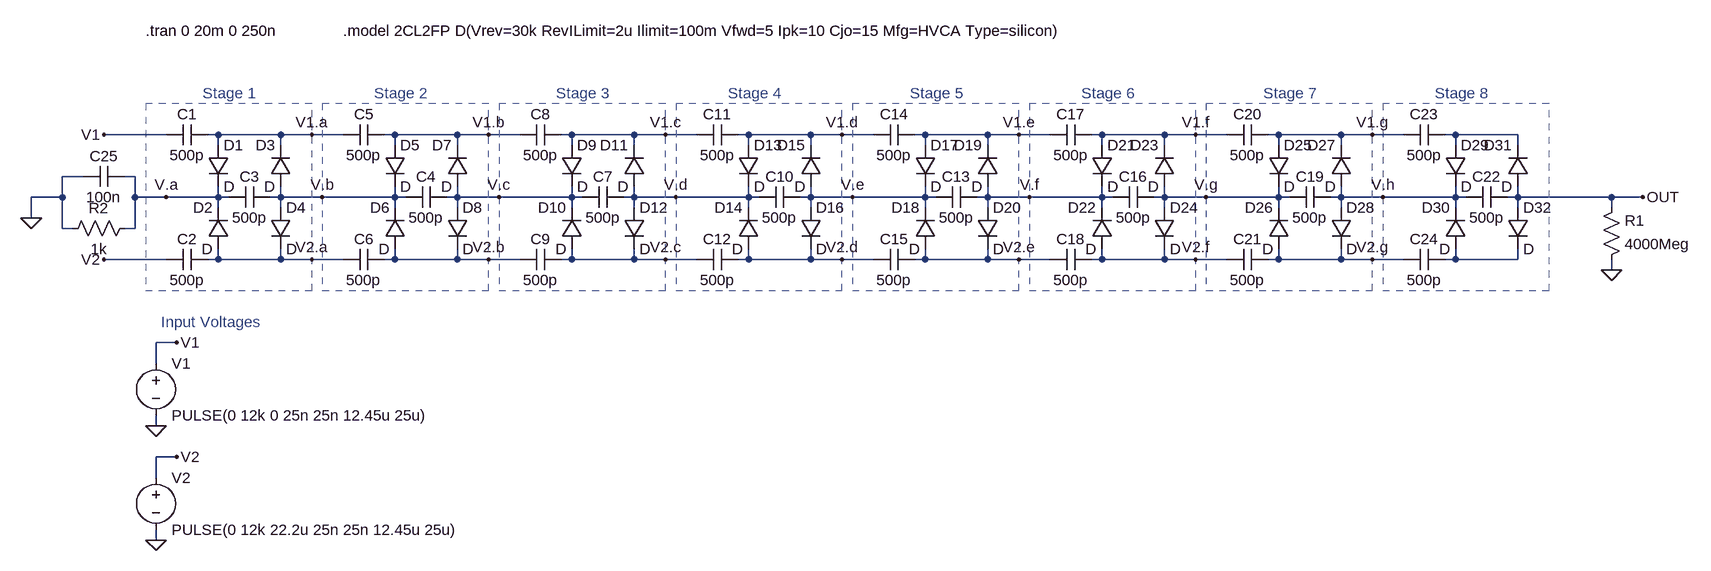
[diagram p0: schematic voltage_mutiplier.asc]
voltage_mutiplier.asc, the LTspice schematic file:
Version 4.1
SHEET 1 2372 756
WIRE 16 112 -80 112
WIRE 96 112 80 112
WIRE 192 112 96 112
WIRE 240 112 192 112
WIRE 288 112 240 112
WIRE 368 112 352 112
WIRE 464 112 368 112
WIRE 512 112 464 112
WIRE 560 112 512 112
WIRE 640 112 624 112
WIRE 736 112 640 112
WIRE 784 112 736 112
WIRE 832 112 784 112
WIRE 912 112 896 112
WIRE 1008 112 912 112
WIRE 1056 112 1008 112
WIRE 1104 112 1056 112
WIRE 1184 112 1168 112
WIRE 1280 112 1184 112
WIRE 1328 112 1280 112
WIRE 1376 112 1328 112
WIRE 1456 112 1440 112
WIRE 1552 112 1456 112
WIRE 1600 112 1552 112
WIRE 1648 112 1600 112
WIRE 1728 112 1712 112
WIRE 1824 112 1728 112
WIRE 1872 112 1824 112
WIRE 1920 112 1872 112
WIRE 2000 112 1984 112
WIRE 2096 112 2000 112
WIRE 96 128 96 112
WIRE 192 128 192 112
WIRE 368 128 368 112
WIRE 464 128 464 112
WIRE 640 128 640 112
WIRE 736 128 736 112
WIRE 912 128 912 112
WIRE 1008 128 1008 112
WIRE 1184 128 1184 112
WIRE 1280 128 1280 112
WIRE 1456 128 1456 112
WIRE 1552 128 1552 112
WIRE 1728 128 1728 112
WIRE 1824 128 1824 112
WIRE 2000 128 2000 112
WIRE 2096 128 2096 112
WIRE -112 176 -144 176
WIRE -32 176 -48 176
WIRE -144 208 -144 176
WIRE -144 208 -192 208
WIRE -32 208 -32 176
WIRE 16 208 -32 208
WIRE 96 208 96 192
WIRE 96 208 16 208
WIRE 112 208 96 208
WIRE 192 208 192 192
WIRE 192 208 176 208
WIRE 256 208 192 208
WIRE 368 208 368 192
WIRE 368 208 256 208
WIRE 384 208 368 208
WIRE 464 208 464 192
WIRE 464 208 448 208
WIRE 528 208 464 208
WIRE 640 208 640 192
WIRE 640 208 528 208
WIRE 656 208 640 208
WIRE 736 208 736 192
WIRE 736 208 720 208
WIRE 800 208 736 208
WIRE 912 208 912 192
WIRE 912 208 800 208
WIRE 928 208 912 208
WIRE 1008 208 1008 192
WIRE 1008 208 992 208
WIRE 1072 208 1008 208
WIRE 1184 208 1184 192
WIRE 1184 208 1072 208
WIRE 1200 208 1184 208
WIRE 1280 208 1280 192
WIRE 1280 208 1264 208
WIRE 1344 208 1280 208
WIRE 1456 208 1456 192
WIRE 1456 208 1344 208
WIRE 1472 208 1456 208
WIRE 1552 208 1552 192
WIRE 1552 208 1536 208
WIRE 1616 208 1552 208
WIRE 1728 208 1728 192
WIRE 1728 208 1616 208
WIRE 1744 208 1728 208
WIRE 1824 208 1824 192
WIRE 1824 208 1808 208
WIRE 1888 208 1824 208
WIRE 2000 208 2000 192
WIRE 2000 208 1888 208
WIRE 2016 208 2000 208
WIRE 2096 208 2096 192
WIRE 2096 208 2080 208
WIRE 2240 208 2096 208
WIRE 2288 208 2240 208
WIRE 96 224 96 208
WIRE 192 224 192 208
WIRE 368 224 368 208
WIRE 464 224 464 208
WIRE 640 224 640 208
WIRE 736 224 736 208
WIRE 912 224 912 208
WIRE 1008 224 1008 208
WIRE 1184 224 1184 208
WIRE 1280 224 1280 208
WIRE 1456 224 1456 208
WIRE 1552 224 1552 208
WIRE 1728 224 1728 208
WIRE 1824 224 1824 208
WIRE 2000 224 2000 208
WIRE 2096 224 2096 208
WIRE 2240 224 2240 208
WIRE -192 240 -192 208
WIRE -144 256 -144 208
WIRE -128 256 -144 256
WIRE -32 256 -32 208
WIRE -32 256 -48 256
WIRE 16 304 -80 304
WIRE 96 304 96 288
WIRE 96 304 80 304
WIRE 192 304 192 288
WIRE 192 304 96 304
WIRE 240 304 192 304
WIRE 288 304 240 304
WIRE 368 304 368 288
WIRE 368 304 352 304
WIRE 464 304 464 288
WIRE 464 304 368 304
WIRE 512 304 464 304
WIRE 560 304 512 304
WIRE 640 304 640 288
WIRE 640 304 624 304
WIRE 736 304 736 288
WIRE 736 304 640 304
WIRE 784 304 736 304
WIRE 832 304 784 304
WIRE 912 304 912 288
WIRE 912 304 896 304
WIRE 1008 304 1008 288
WIRE 1008 304 912 304
WIRE 1056 304 1008 304
WIRE 1104 304 1056 304
WIRE 1184 304 1184 288
WIRE 1184 304 1168 304
WIRE 1280 304 1280 288
WIRE 1280 304 1184 304
WIRE 1328 304 1280 304
WIRE 1376 304 1328 304
WIRE 1456 304 1456 288
WIRE 1456 304 1440 304
WIRE 1552 304 1552 288
WIRE 1552 304 1456 304
WIRE 1600 304 1552 304
WIRE 1648 304 1600 304
WIRE 1728 304 1728 288
WIRE 1728 304 1712 304
WIRE 1824 304 1824 288
WIRE 1824 304 1728 304
WIRE 1872 304 1824 304
WIRE 1920 304 1872 304
WIRE 2000 304 2000 288
WIRE 2000 304 1984 304
WIRE 2096 304 2096 288
WIRE 2096 304 2000 304
WIRE 2240 320 2240 304
WIRE 32 432 0 432
WIRE 0 464 0 432
WIRE 0 560 0 544
WIRE 32 608 0 608
WIRE 0 640 0 608
WIRE 0 736 0 720
FLAG 2240 320 0
FLAG 2288 208 OUT
FLAG -192 240 0
FLAG -80 112 V1
FLAG -80 304 V2
FLAG 240 304 V2.a
FLAG 512 304 V2.b
FLAG 784 304 V2.c
FLAG 1056 304 V2.d
FLAG 1328 304 V2.e
FLAG 1600 304 V2.f
FLAG 1872 304 V2.g
FLAG 240 112 V1.a
FLAG 512 112 V1.b
FLAG 784 112 V1.c
FLAG 1056 112 V1.d
FLAG 1328 112 V1.e
FLAG 1600 112 V1.f
FLAG 1872 112 V1.g
FLAG 0 560 0
FLAG 0 736 0
FLAG 32 608 V2
FLAG 32 432 V1
FLAG 16 208 V.a
FLAG 256 208 V.b
FLAG 528 208 V.c
FLAG 800 208 V.d
FLAG 1072 208 V.e
FLAG 1344 208 V.f
FLAG 1616 208 V.g
FLAG 1888 208 V.h
SYMBOL diode 80 128 R0
SYMATTR InstName D1
SYMBOL diode 112 288 R180
WINDOW 0 24 64 Left 2
WINDOW 3 24 0 Left 2
SYMATTR InstName D2
SYMBOL cap 176 192 R90
WINDOW 0 0 32 VBottom 2
WINDOW 3 32 32 VTop 2
SYMATTR InstName C3
SYMATTR Value 500p
SYMBOL cap 80 96 R90
WINDOW 0 0 32 VBottom 2
WINDOW 3 32 32 VTop 2
SYMATTR InstName C1
SYMATTR Value 500p
SYMBOL cap 80 288 R90
WINDOW 0 0 32 VBottom 2
WINDOW 3 32 32 VTop 2
SYMATTR InstName C2
SYMATTR Value 500p
SYMBOL diode 208 192 R180
WINDOW 0 24 64 Left 2
WINDOW 3 24 0 Left 2
SYMATTR InstName D3
SYMBOL diode 176 224 R0
SYMATTR InstName D4
SYMBOL diode 352 128 R0
SYMATTR InstName D5
SYMBOL diode 384 288 R180
WINDOW 0 24 64 Left 2
WINDOW 3 24 0 Left 2
SYMATTR InstName D6
SYMBOL cap 448 192 R90
WINDOW 0 0 32 VBottom 2
WINDOW 3 32 32 VTop 2
SYMATTR InstName C4
SYMATTR Value 500p
SYMBOL cap 352 96 R90
WINDOW 0 0 32 VBottom 2
WINDOW 3 32 32 VTop 2
SYMATTR InstName C5
SYMATTR Value 500p
SYMBOL cap 352 288 R90
WINDOW 0 0 32 VBottom 2
WINDOW 3 32 32 VTop 2
SYMATTR InstName C6
SYMATTR Value 500p
SYMBOL diode 480 192 R180
WINDOW 0 24 64 Left 2
WINDOW 3 24 0 Left 2
SYMATTR InstName D7
SYMBOL diode 448 224 R0
SYMATTR InstName D8
SYMBOL diode 624 128 R0
SYMATTR InstName D9
SYMBOL diode 656 288 R180
WINDOW 0 24 64 Left 2
WINDOW 3 24 0 Left 2
SYMATTR InstName D10
SYMBOL cap 720 192 R90
WINDOW 0 0 32 VBottom 2
WINDOW 3 32 32 VTop 2
SYMATTR InstName C7
SYMATTR Value 500p
SYMBOL cap 624 96 R90
WINDOW 0 0 32 VBottom 2
WINDOW 3 32 32 VTop 2
SYMATTR InstName C8
SYMATTR Value 500p
SYMBOL cap 624 288 R90
WINDOW 0 0 32 VBottom 2
WINDOW 3 32 32 VTop 2
SYMATTR InstName C9
SYMATTR Value 500p
SYMBOL diode 752 192 R180
WINDOW 0 24 64 Left 2
WINDOW 3 24 0 Left 2
SYMATTR InstName D11
SYMBOL diode 720 224 R0
SYMATTR InstName D12
SYMBOL diode 896 128 R0
SYMATTR InstName D13
SYMBOL diode 928 288 R180
WINDOW 0 24 64 Left 2
WINDOW 3 24 0 Left 2
SYMATTR InstName D14
SYMBOL cap 992 192 R90
WINDOW 0 0 32 VBottom 2
WINDOW 3 32 32 VTop 2
SYMATTR InstName C10
SYMATTR Value 500p
SYMBOL cap 896 96 R90
WINDOW 0 0 32 VBottom 2
WINDOW 3 32 32 VTop 2
SYMATTR InstName C11
SYMATTR Value 500p
SYMBOL cap 896 288 R90
WINDOW 0 0 32 VBottom 2
WINDOW 3 32 32 VTop 2
SYMATTR InstName C12
SYMATTR Value 500p
SYMBOL diode 1024 192 R180
WINDOW 0 24 64 Left 2
WINDOW 3 24 0 Left 2
SYMATTR InstName D15
SYMBOL diode 992 224 R0
SYMATTR InstName D16
SYMBOL diode 1168 128 R0
SYMATTR InstName D17
SYMBOL diode 1200 288 R180
WINDOW 0 24 64 Left 2
WINDOW 3 24 0 Left 2
SYMATTR InstName D18
SYMBOL cap 1264 192 R90
WINDOW 0 0 32 VBottom 2
WINDOW 3 32 32 VTop 2
SYMATTR InstName C13
SYMATTR Value 500p
SYMBOL cap 1168 96 R90
WINDOW 0 0 32 VBottom 2
WINDOW 3 32 32 VTop 2
SYMATTR InstName C14
SYMATTR Value 500p
SYMBOL cap 1168 288 R90
WINDOW 0 0 32 VBottom 2
WINDOW 3 32 32 VTop 2
SYMATTR InstName C15
SYMATTR Value 500p
SYMBOL diode 1296 192 R180
WINDOW 0 24 64 Left 2
WINDOW 3 24 0 Left 2
SYMATTR InstName D19
SYMBOL diode 1264 224 R0
SYMATTR InstName D20
SYMBOL diode 1440 128 R0
SYMATTR InstName D21
SYMBOL diode 1472 288 R180
WINDOW 0 24 64 Left 2
WINDOW 3 24 0 Left 2
SYMATTR InstName D22
SYMBOL cap 1536 192 R90
WINDOW 0 0 32 VBottom 2
WINDOW 3 32 32 VTop 2
SYMATTR InstName C16
SYMATTR Value 500p
SYMBOL cap 1440 96 R90
WINDOW 0 0 32 VBottom 2
WINDOW 3 32 32 VTop 2
SYMATTR InstName C17
SYMATTR Value 500p
SYMBOL cap 1440 288 R90
WINDOW 0 0 32 VBottom 2
WINDOW 3 32 32 VTop 2
SYMATTR InstName C18
SYMATTR Value 500p
SYMBOL diode 1568 192 R180
WINDOW 0 24 64 Left 2
WINDOW 3 24 0 Left 2
SYMATTR InstName D23
SYMBOL diode 1536 224 R0
SYMATTR InstName D24
SYMBOL diode 1712 128 R0
SYMATTR InstName D25
SYMBOL diode 1744 288 R180
WINDOW 0 24 64 Left 2
WINDOW 3 24 0 Left 2
SYMATTR InstName D26
SYMBOL cap 1808 192 R90
WINDOW 0 0 32 VBottom 2
WINDOW 3 32 32 VTop 2
SYMATTR InstName C19
SYMATTR Value 500p
SYMBOL cap 1712 96 R90
WINDOW 0 0 32 VBottom 2
WINDOW 3 32 32 VTop 2
SYMATTR InstName C20
SYMATTR Value 500p
SYMBOL cap 1712 288 R90
WINDOW 0 0 32 VBottom 2
WINDOW 3 32 32 VTop 2
SYMATTR InstName C21
SYMATTR Value 500p
SYMBOL diode 1840 192 R180
WINDOW 0 24 64 Left 2
WINDOW 3 24 0 Left 2
SYMATTR InstName D27
SYMBOL diode 1808 224 R0
SYMATTR InstName D28
SYMBOL diode 1984 128 R0
SYMATTR InstName D29
SYMBOL diode 2016 288 R180
WINDOW 0 24 64 Left 2
WINDOW 3 24 0 Left 2
SYMATTR InstName D30
SYMBOL cap 2080 192 R90
WINDOW 0 0 32 VBottom 2
WINDOW 3 32 32 VTop 2
SYMATTR InstName C22
SYMATTR Value 500p
SYMBOL cap 1984 96 R90
WINDOW 0 0 32 VBottom 2
WINDOW 3 32 32 VTop 2
SYMATTR InstName C23
SYMATTR Value 500p
SYMBOL cap 1984 288 R90
WINDOW 0 0 32 VBottom 2
WINDOW 3 32 32 VTop 2
SYMATTR InstName C24
SYMATTR Value 500p
SYMBOL diode 2112 192 R180
WINDOW 0 24 64 Left 2
WINDOW 3 24 0 Left 2
SYMATTR InstName D31
SYMBOL diode 2080 224 R0
SYMATTR InstName D32
SYMBOL res 2224 320 M180
WINDOW 0 36 76 Left 2
WINDOW 3 36 40 Left 2
SYMATTR InstName R1
SYMATTR Value 4000Meg
SYMATTR SpiceLine tol=1
SYMBOL cap -48 160 R90
WINDOW 0 0 32 VBottom 2
WINDOW 3 32 32 VTop 2
SYMATTR InstName C25
SYMATTR Value 100n
SYMATTR SpiceLine V=100
SYMBOL res -32 240 R90
WINDOW 0 0 56 VBottom 2
WINDOW 3 32 56 VTop 2
SYMATTR InstName R2
SYMATTR Value 1k
SYMATTR SpiceLine tol=1
SYMBOL voltage 0 448 R0
WINDOW 123 0 0 Left 0
WINDOW 39 0 0 Left 0
SYMATTR InstName V1
SYMATTR Value PULSE(0 12k 0 25n 25n 12.45u 25u)
SYMBOL voltage 0 624 R0
WINDOW 123 0 0 Left 0
WINDOW 39 0 0 Left 0
SYMATTR InstName V2
SYMATTR Value PULSE(0 12k 22.2u 25n 25n 12.45u 25u)
TEXT 72 48 Left 2 ;Stage 1
TEXT 336 48 Left 2 ;Stage 2
TEXT 616 48 Left 2 ;Stage 3
TEXT 880 48 Left 2 ;Stage 4
TEXT 1160 48 Left 2 ;Stage 5
TEXT 1424 48 Left 2 ;Stage 6
TEXT 1704 48 Left 2 ;Stage 7
TEXT 1968 48 Left 2 ;Stage 8
TEXT 8 400 Left 2 ;Input Voltages
TEXT -16 -48 Left 2 !.tran 0 20m 0 250n
TEXT 288 -48 Left 2 !.model 2CL2FP D(Vrev=30k RevILimit=2u Ilimit=100m Vfwd=5 Ipk=10 Cjo=15 Mfg=HVCA Type=silicon)
RECTANGLE Normal 240 64 -16 352 2
RECTANGLE Normal 512 64 256 352 2
RECTANGLE Normal 784 64 528 352 2
RECTANGLE Normal 1056 64 800 352 2
RECTANGLE Normal 1328 64 1072 352 2
RECTANGLE Normal 1600 64 1344 352 2
RECTANGLE Normal 1872 64 1616 352 2
RECTANGLE Normal 2144 64 1888 352 2

The netlist it stands for:
* voltage_mutiplier.asc
D1 V1.a V.a D
D2 V2.a V.a D
C3 V.b V.a 500p
C1 V1.a V1 500p
C2 V2.a V2 500p
D3 V.b V1.a D
D4 V.b V2.a D
D5 V1.b V.b D
D6 V2.b V.b D
C4 V.c V.b 500p
C5 V1.b V1.a 500p
C6 V2.b V2.a 500p
D7 V.c V1.b D
D8 V.c V2.b D
D9 V1.c V.c D
D10 V2.c V.c D
C7 V.d V.c 500p
C8 V1.c V1.b 500p
C9 V2.c V2.b 500p
D11 V.d V1.c D
D12 V.d V2.c D
D13 V1.d V.d D
D14 V2.d V.d D
C10 V.e V.d 500p
C11 V1.d V1.c 500p
C12 V2.d V2.c 500p
D15 V.e V1.d D
D16 V.e V2.d D
D17 V1.e V.e D
D18 V2.e V.e D
C13 V.f V.e 500p
C14 V1.e V1.d 500p
C15 V2.e V2.d 500p
D19 V.f V1.e D
D20 V.f V2.e D
D21 V1.f V.f D
D22 V2.f V.f D
C16 V.g V.f 500p
C17 V1.f V1.e 500p
C18 V2.f V2.e 500p
D23 V.g V1.f D
D24 V.g V2.f D
D25 V1.g V.g D
D26 V2.g V.g D
C19 V.h V.g 500p
C20 V1.g V1.f 500p
C21 V2.g V2.f 500p
D27 V.h V1.g D
D28 V.h V2.g D
D29 N001 V.h D
D30 N002 V.h D
C22 OUT V.h 500p
C23 N001 V1.g 500p
C24 N002 V2.g 500p
D31 OUT N001 D
D32 OUT N002 D
R1 0 OUT 4000Meg tol=1
C25 V.a 0 100n V=100
R2 V.a 0 1k tol=1
V1 V1 0 PULSE(0 12k 0 25n 25n 12.45u 25u)
V2 V2 0 PULSE(0 12k 22.2u 25n 25n 12.45u 25u)
.model D D
.lib standard.dio
* Stage 1
* Stage 2
* Stage 3
* Stage 4
* Stage 5
* Stage 6
* Stage 7
* Stage 8
* Input Voltages
.tran 0 20m 0 250n
.model 2CL2FP D(Vrev=30k RevILimit=2u Ilimit=100m Vfwd=5 Ipk=10 Cjo=15 Mfg=HVCA Type=silicon)
.backanno
.end